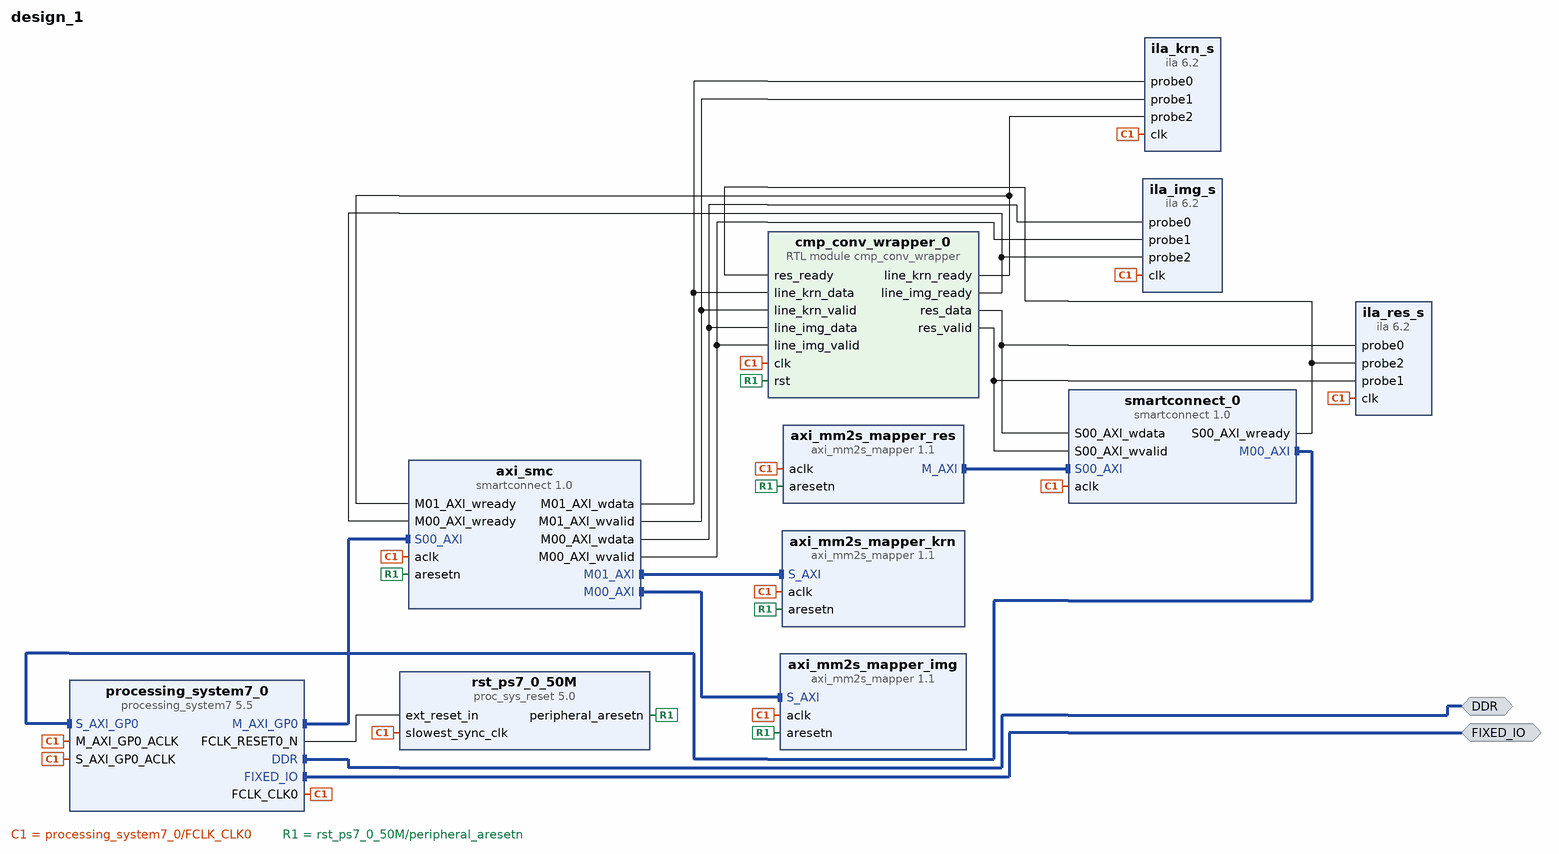
[diagram p0: block diagram of the top level]
# Vivado block design design_1, xc7z020clg400-1, Vivado 2022.1
create_bd_design design_1

create_bd_intf_port -mode Master -vlnv xilinx.com:interface:ddrx_rtl:1.0 DDR
create_bd_intf_port -mode Master -vlnv xilinx.com:display_processing_system7:fixedio_rtl:1.0 FIXED_IO

create_bd_cell -type ip -vlnv xilinx.com:ip:processing_system7:5.5 processing_system7_0
set_property -dict [list \
  CONFIG.PCW_APU_PERIPHERAL_FREQMHZ 667 \
  CONFIG.PCW_ENET0_ENET0_IO {MIO 16 .. 27} \
  CONFIG.PCW_ENET0_GRP_MDIO_ENABLE 1 \
  CONFIG.PCW_ENET0_GRP_MDIO_IO {MIO 52 .. 53} \
  CONFIG.PCW_ENET0_PERIPHERAL_ENABLE 1 \
  CONFIG.PCW_ENET0_RESET_ENABLE 0 \
  CONFIG.PCW_ENET_RESET_ENABLE 1 \
  CONFIG.PCW_ENET_RESET_SELECT {Share reset pin} \
  CONFIG.PCW_GPIO_MIO_GPIO_ENABLE 1 \
  CONFIG.PCW_GPIO_MIO_GPIO_IO MIO \
  CONFIG.PCW_I2C_RESET_ENABLE 1 \
  CONFIG.PCW_PRESET_BANK1_VOLTAGE {LVCMOS 1.8V} \
  CONFIG.PCW_QSPI_GRP_FBCLK_ENABLE 1 \
  CONFIG.PCW_QSPI_GRP_FBCLK_IO {MIO 8} \
  CONFIG.PCW_QSPI_GRP_SINGLE_SS_ENABLE 1 \
  CONFIG.PCW_QSPI_GRP_SINGLE_SS_IO {MIO 1 .. 6} \
  CONFIG.PCW_QSPI_PERIPHERAL_ENABLE 1 \
  CONFIG.PCW_QSPI_QSPI_IO {MIO 1 .. 6} \
  CONFIG.PCW_SD0_GRP_CD_ENABLE 1 \
  CONFIG.PCW_SD0_GRP_CD_IO {MIO 47} \
  CONFIG.PCW_SD0_GRP_WP_ENABLE 0 \
  CONFIG.PCW_SD0_PERIPHERAL_ENABLE 1 \
  CONFIG.PCW_SD0_SD0_IO {MIO 40 .. 45} \
  CONFIG.PCW_SDIO_PERIPHERAL_FREQMHZ 50 \
  CONFIG.PCW_SINGLE_QSPI_DATA_MODE x4 \
  CONFIG.PCW_UART1_PERIPHERAL_ENABLE 1 \
  CONFIG.PCW_UART1_UART1_IO {MIO 48 .. 49} \
  CONFIG.PCW_UART_PERIPHERAL_FREQMHZ 100 \
  CONFIG.PCW_UIPARAM_DDR_FREQ_MHZ 533.333333 \
  CONFIG.PCW_UIPARAM_DDR_MEMORY_TYPE {DDR 3 (Low Voltage)} \
  CONFIG.PCW_UIPARAM_DDR_PARTNO {MT41K256M16 RE-125} \
  CONFIG.PCW_USB0_PERIPHERAL_ENABLE 1 \
  CONFIG.PCW_USB0_RESET_ENABLE 1 \
  CONFIG.PCW_USB0_RESET_IO {MIO 46} \
  CONFIG.PCW_USB0_USB0_IO {MIO 28 .. 39} \
  CONFIG.PCW_USB_RESET_ENABLE 1 \
  CONFIG.PCW_USB_RESET_SELECT {Share reset pin} \
  CONFIG.PCW_USE_S_AXI_GP0 1 \
] [get_bd_cells processing_system7_0]
# 295 more settings of processing_system7_0 are not shown: defaults, MIO pin electricals, DDR timing, and values the tool derives
create_bd_cell -type ip -vlnv xilinx.com:ip:proc_sys_reset:5.0 rst_ps7_0_50M
create_bd_cell -type ip -vlnv xilinx.com:ip:smartconnect:1.0 axi_smc
set_property -dict {CONFIG.NUM_MI 2 CONFIG.NUM_SI 1} [get_bd_cells axi_smc]
create_bd_cell -type ip -vlnv xilinx.com:ip:axi_mm2s_mapper:1.1 axi_mm2s_mapper_krn
set_property -dict {CONFIG.INTERFACES S_AXI CONFIG.TDATA_NUM_BYTES 4} [get_bd_cells axi_mm2s_mapper_krn]
create_bd_cell -type ip -vlnv xilinx.com:ip:axi_mm2s_mapper:1.1 axi_mm2s_mapper_res
set_property -dict {CONFIG.INTERFACES M_AXI CONFIG.TDATA_NUM_BYTES 4} [get_bd_cells axi_mm2s_mapper_res]
create_bd_cell -type ip -vlnv xilinx.com:ip:smartconnect:1.0 smartconnect_0
set_property -dict {CONFIG.NUM_SI 1} [get_bd_cells smartconnect_0]
create_bd_cell -type ip -vlnv xilinx.com:ip:ila:6.2 ila_img_s
set_property -dict [list \
  CONFIG.C_ENABLE_ILA_AXI_MON false \
  CONFIG.C_MONITOR_TYPE Native \
  CONFIG.C_NUM_OF_PROBES 3 \
  CONFIG.C_PROBE0_WIDTH 32 \
  CONFIG.C_SLOT_0_AXI_PROTOCOL AXI4S \
] [get_bd_cells ila_img_s]
create_bd_cell -type module -reference cmp_conv_wrapper cmp_conv_wrapper_0
create_bd_cell -type ip -vlnv xilinx.com:ip:axi_mm2s_mapper:1.1 axi_mm2s_mapper_img
set_property -dict {CONFIG.INTERFACES S_AXI CONFIG.TDATA_NUM_BYTES 4} [get_bd_cells axi_mm2s_mapper_img]
create_bd_cell -type ip -vlnv xilinx.com:ip:ila:6.2 ila_res_s
set_property -dict [list \
  CONFIG.C_ENABLE_ILA_AXI_MON false \
  CONFIG.C_MONITOR_TYPE Native \
  CONFIG.C_NUM_OF_PROBES 3 \
  CONFIG.C_PROBE0_WIDTH 32 \
] [get_bd_cells ila_res_s]
create_bd_cell -type ip -vlnv xilinx.com:ip:ila:6.2 ila_krn_s
set_property -dict [list \
  CONFIG.C_ENABLE_ILA_AXI_MON false \
  CONFIG.C_MONITOR_TYPE Native \
  CONFIG.C_NUM_OF_PROBES 3 \
  CONFIG.C_PROBE0_WIDTH 32 \
] [get_bd_cells ila_krn_s]

# ---- connections ----

connect_bd_intf_net -intf_net axi_mm2s_mapper_2_M_AXI [get_bd_intf_pins smartconnect_0/S00_AXI] [get_bd_intf_pins axi_mm2s_mapper_res/M_AXI]
connect_bd_intf_net [get_bd_intf_pins axi_smc/M00_AXI] [get_bd_intf_pins axi_mm2s_mapper_img/S_AXI]
connect_bd_intf_net [get_bd_intf_pins axi_smc/M01_AXI] [get_bd_intf_pins axi_mm2s_mapper_krn/S_AXI]
connect_bd_intf_net [get_bd_intf_ports DDR] [get_bd_intf_pins processing_system7_0/DDR]
connect_bd_intf_net [get_bd_intf_ports FIXED_IO] [get_bd_intf_pins processing_system7_0/FIXED_IO]
connect_bd_intf_net [get_bd_intf_pins processing_system7_0/M_AXI_GP0] [get_bd_intf_pins axi_smc/S00_AXI]
connect_bd_intf_net [get_bd_intf_pins smartconnect_0/M00_AXI] [get_bd_intf_pins processing_system7_0/S_AXI_GP0]
connect_bd_net -net axi_mm2s_mapper_0_m_axis_tdata [get_bd_pins axi_smc/M00_AXI_wdata] \
  [get_bd_pins cmp_conv_wrapper_0/line_img_data] [get_bd_pins ila_img_s/probe0]
connect_bd_net -net axi_mm2s_mapper_0_m_axis_tvalid [get_bd_pins axi_smc/M00_AXI_wvalid] \
  [get_bd_pins cmp_conv_wrapper_0/line_img_valid] [get_bd_pins ila_img_s/probe1]
connect_bd_net [get_bd_pins axi_smc/M01_AXI_wdata] [get_bd_pins cmp_conv_wrapper_0/line_krn_data] [get_bd_pins ila_krn_s/probe0]
connect_bd_net [get_bd_pins axi_smc/M01_AXI_wvalid] [get_bd_pins cmp_conv_wrapper_0/line_krn_valid] [get_bd_pins ila_krn_s/probe1]
connect_bd_net [get_bd_pins cmp_conv_wrapper_0/line_img_ready] [get_bd_pins ila_img_s/probe2] [get_bd_pins axi_smc/M00_AXI_wready]
connect_bd_net [get_bd_pins cmp_conv_wrapper_0/line_krn_ready] [get_bd_pins axi_smc/M01_AXI_wready] [get_bd_pins ila_krn_s/probe2]
connect_bd_net [get_bd_pins cmp_conv_wrapper_0/res_data] [get_bd_pins smartconnect_0/S00_AXI_wdata] [get_bd_pins ila_res_s/probe0]
connect_bd_net [get_bd_pins cmp_conv_wrapper_0/res_valid] [get_bd_pins smartconnect_0/S00_AXI_wvalid] [get_bd_pins ila_res_s/probe1]
connect_bd_net [get_bd_pins processing_system7_0/FCLK_CLK0] \
  [get_bd_pins rst_ps7_0_50M/slowest_sync_clk] [get_bd_pins processing_system7_0/M_AXI_GP0_ACLK] [get_bd_pins axi_smc/aclk] \
  [get_bd_pins axi_mm2s_mapper_krn/aclk] [get_bd_pins processing_system7_0/S_AXI_GP0_ACLK] [get_bd_pins smartconnect_0/aclk] \
  [get_bd_pins axi_mm2s_mapper_res/aclk] [get_bd_pins ila_img_s/clk] [get_bd_pins cmp_conv_wrapper_0/clk] \
  [get_bd_pins axi_mm2s_mapper_img/aclk] [get_bd_pins ila_res_s/clk] [get_bd_pins ila_krn_s/clk]
connect_bd_net [get_bd_pins processing_system7_0/FCLK_RESET0_N] [get_bd_pins rst_ps7_0_50M/ext_reset_in]
connect_bd_net [get_bd_pins rst_ps7_0_50M/peripheral_aresetn] \
  [get_bd_pins axi_smc/aresetn] [get_bd_pins axi_mm2s_mapper_krn/aresetn] [get_bd_pins cmp_conv_wrapper_0/rst] \
  [get_bd_pins axi_mm2s_mapper_res/aresetn] [get_bd_pins axi_mm2s_mapper_img/aresetn]
connect_bd_net [get_bd_pins smartconnect_0/S00_AXI_wready] [get_bd_pins cmp_conv_wrapper_0/res_ready] [get_bd_pins ila_res_s/probe2]

# ---- address map ----
assign_bd_address -offset 0x00000000 -range 64K -target_address_space [get_bd_addr_spaces axi_mm2s_mapper_res/Bridge] [get_bd_addr_segs processing_system7_0/S_AXI_GP0/GP0_DDR_LOWOCM]
assign_bd_address -offset 0x40000000 -range 64K -target_address_space [get_bd_addr_spaces axi_mm2s_mapper_res/Bridge] [get_bd_addr_segs processing_system7_0/S_AXI_GP0/GP0_M_AXI_GP0]
assign_bd_address -offset 0xE0000000 -range 64K -target_address_space [get_bd_addr_spaces axi_mm2s_mapper_res/Bridge] [get_bd_addr_segs processing_system7_0/S_AXI_GP0/GP0_IOP]
assign_bd_address -offset 0xFC000000 -range 64K -target_address_space [get_bd_addr_spaces axi_mm2s_mapper_res/Bridge] [get_bd_addr_segs processing_system7_0/S_AXI_GP0/GP0_QSPI_LINEAR]
assign_bd_address -offset 0x43C00000 -range 64K -target_address_space [get_bd_addr_spaces processing_system7_0/Data] [get_bd_addr_segs axi_mm2s_mapper_img/S_AXI/Reg]
assign_bd_address -offset 0x43C10000 -range 64K -target_address_space [get_bd_addr_spaces processing_system7_0/Data] [get_bd_addr_segs axi_mm2s_mapper_krn/S_AXI/Reg]

validate_bd_design
save_bd_design
